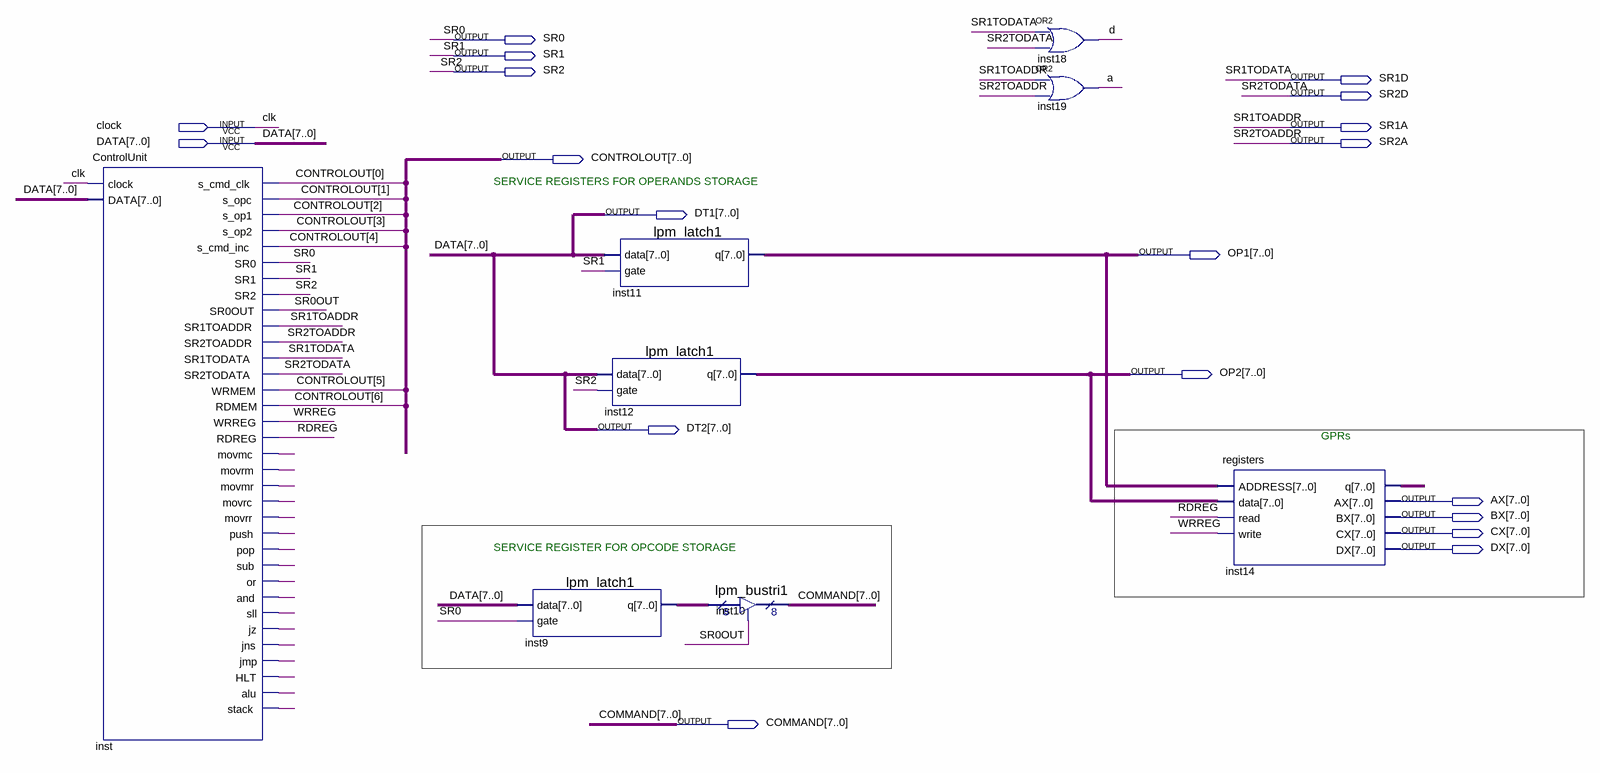
[diagram p0: schematic sheet]
// Quartus schematic transition.bdf as structural Verilog: 8 symbols, 19 pins
module transition (
  input  clock,
  input  [7:0] DATA,
  output SR0,
  output SR1,
  output SR2,
  output SR1D,
  output SR2D,
  output SR1A,
  output SR2A,
  output [7:0] CONTROLOUT,
  output [7:0] DT1,
  output [7:0] OP1,
  output [7:0] OP2,
  output [7:0] DT2,
  output [7:0] AX,
  output [7:0] BX,
  output [7:0] CX,
  output [7:0] DX,
  output [7:0] COMMAND
);

  wire a, d, inst_alu, inst_and, inst_hlt, inst_jmp, inst_jns, inst_jz, inst_movmc, inst_movmr, inst_movrc,
       inst_movrm, inst_movrr, inst_or, inst_pop, inst_push, inst_sll, inst_stack, inst_sub, RDREG, SR0OUT,
       WRREG;
  wire [7:0] inst9_q, inst14_q;

  ControlUnit inst (
    .clock(clock), .DATA(DATA), .s_cmd_clk(CONTROLOUT[0]), .s_opc(CONTROLOUT[1]), .s_op1(CONTROLOUT[2]),
    .s_op2(CONTROLOUT[3]), .s_cmd_inc(CONTROLOUT[4]), .SR0(SR0), .SR1(SR1), .SR2(SR2), .SR0OUT(SR0OUT),
    .SR1TOADDR(SR1A), .SR2TOADDR(SR2A), .SR1TODATA(SR1D), .SR2TODATA(SR2D), .WRMEM(CONTROLOUT[5]),
    .RDMEM(CONTROLOUT[6]), .WRREG(WRREG), .RDREG(RDREG), .movmc(inst_movmc), .movrm(inst_movrm),
    .movmr(inst_movmr), .movrc(inst_movrc), .movrr(inst_movrr), .push(inst_push), .pop(inst_pop),
    .sub(inst_sub), .\or (inst_or), .\and (inst_and), .sll(inst_sll), .jz(inst_jz), .jns(inst_jns),
    .jmp(inst_jmp), .HLT(inst_hlt), .alu(inst_alu), .stack(inst_stack));
  lpm_latch1 inst9 (.data(DATA), .gate(SR0), .q(inst9_q));
  lpm_latch1 inst11 (.data(DATA), .gate(SR1), .q(OP1));
  lpm_latch1 inst12 (.data(DATA), .gate(SR2), .q(OP2));
  lpm_bustri1 inst10 (.enabledt(SR0OUT), .data(inst9_q), .tridata(COMMAND));
  or inst18 (d, SR1D, SR2D);
  or inst19 (a, SR1A, SR2A);
  registers inst14 (
    .ADDRESS(OP1), .data(OP2), .read(RDREG), .write(WRREG), .q(inst14_q), .AX(AX), .BX(BX), .CX(CX), .DX(DX));

  assign DT1 = DATA;
  assign DT2 = DATA;

  // Other names for the same wires on the sheet: clk = clock; SR1TOADDR = SR1A; SR1TODATA = SR1D; SR2TOADDR = SR2A;
  //   SR2TODATA = SR2D

  // Notes on the sheet:
  //   SERVICE REGISTERS FOR OPERANDS STORAGE
  //   GPRs
  //   SERVICE REGISTER FOR OPCODE STORAGE
endmodule
